# Altium schematic sheet Sheet1.SchDoc
size 420 x 297 mm; Organization: ФЕЛ, ДК-81; DocumentNumber: 1; SheetNumber: 1; SheetTotal: 1
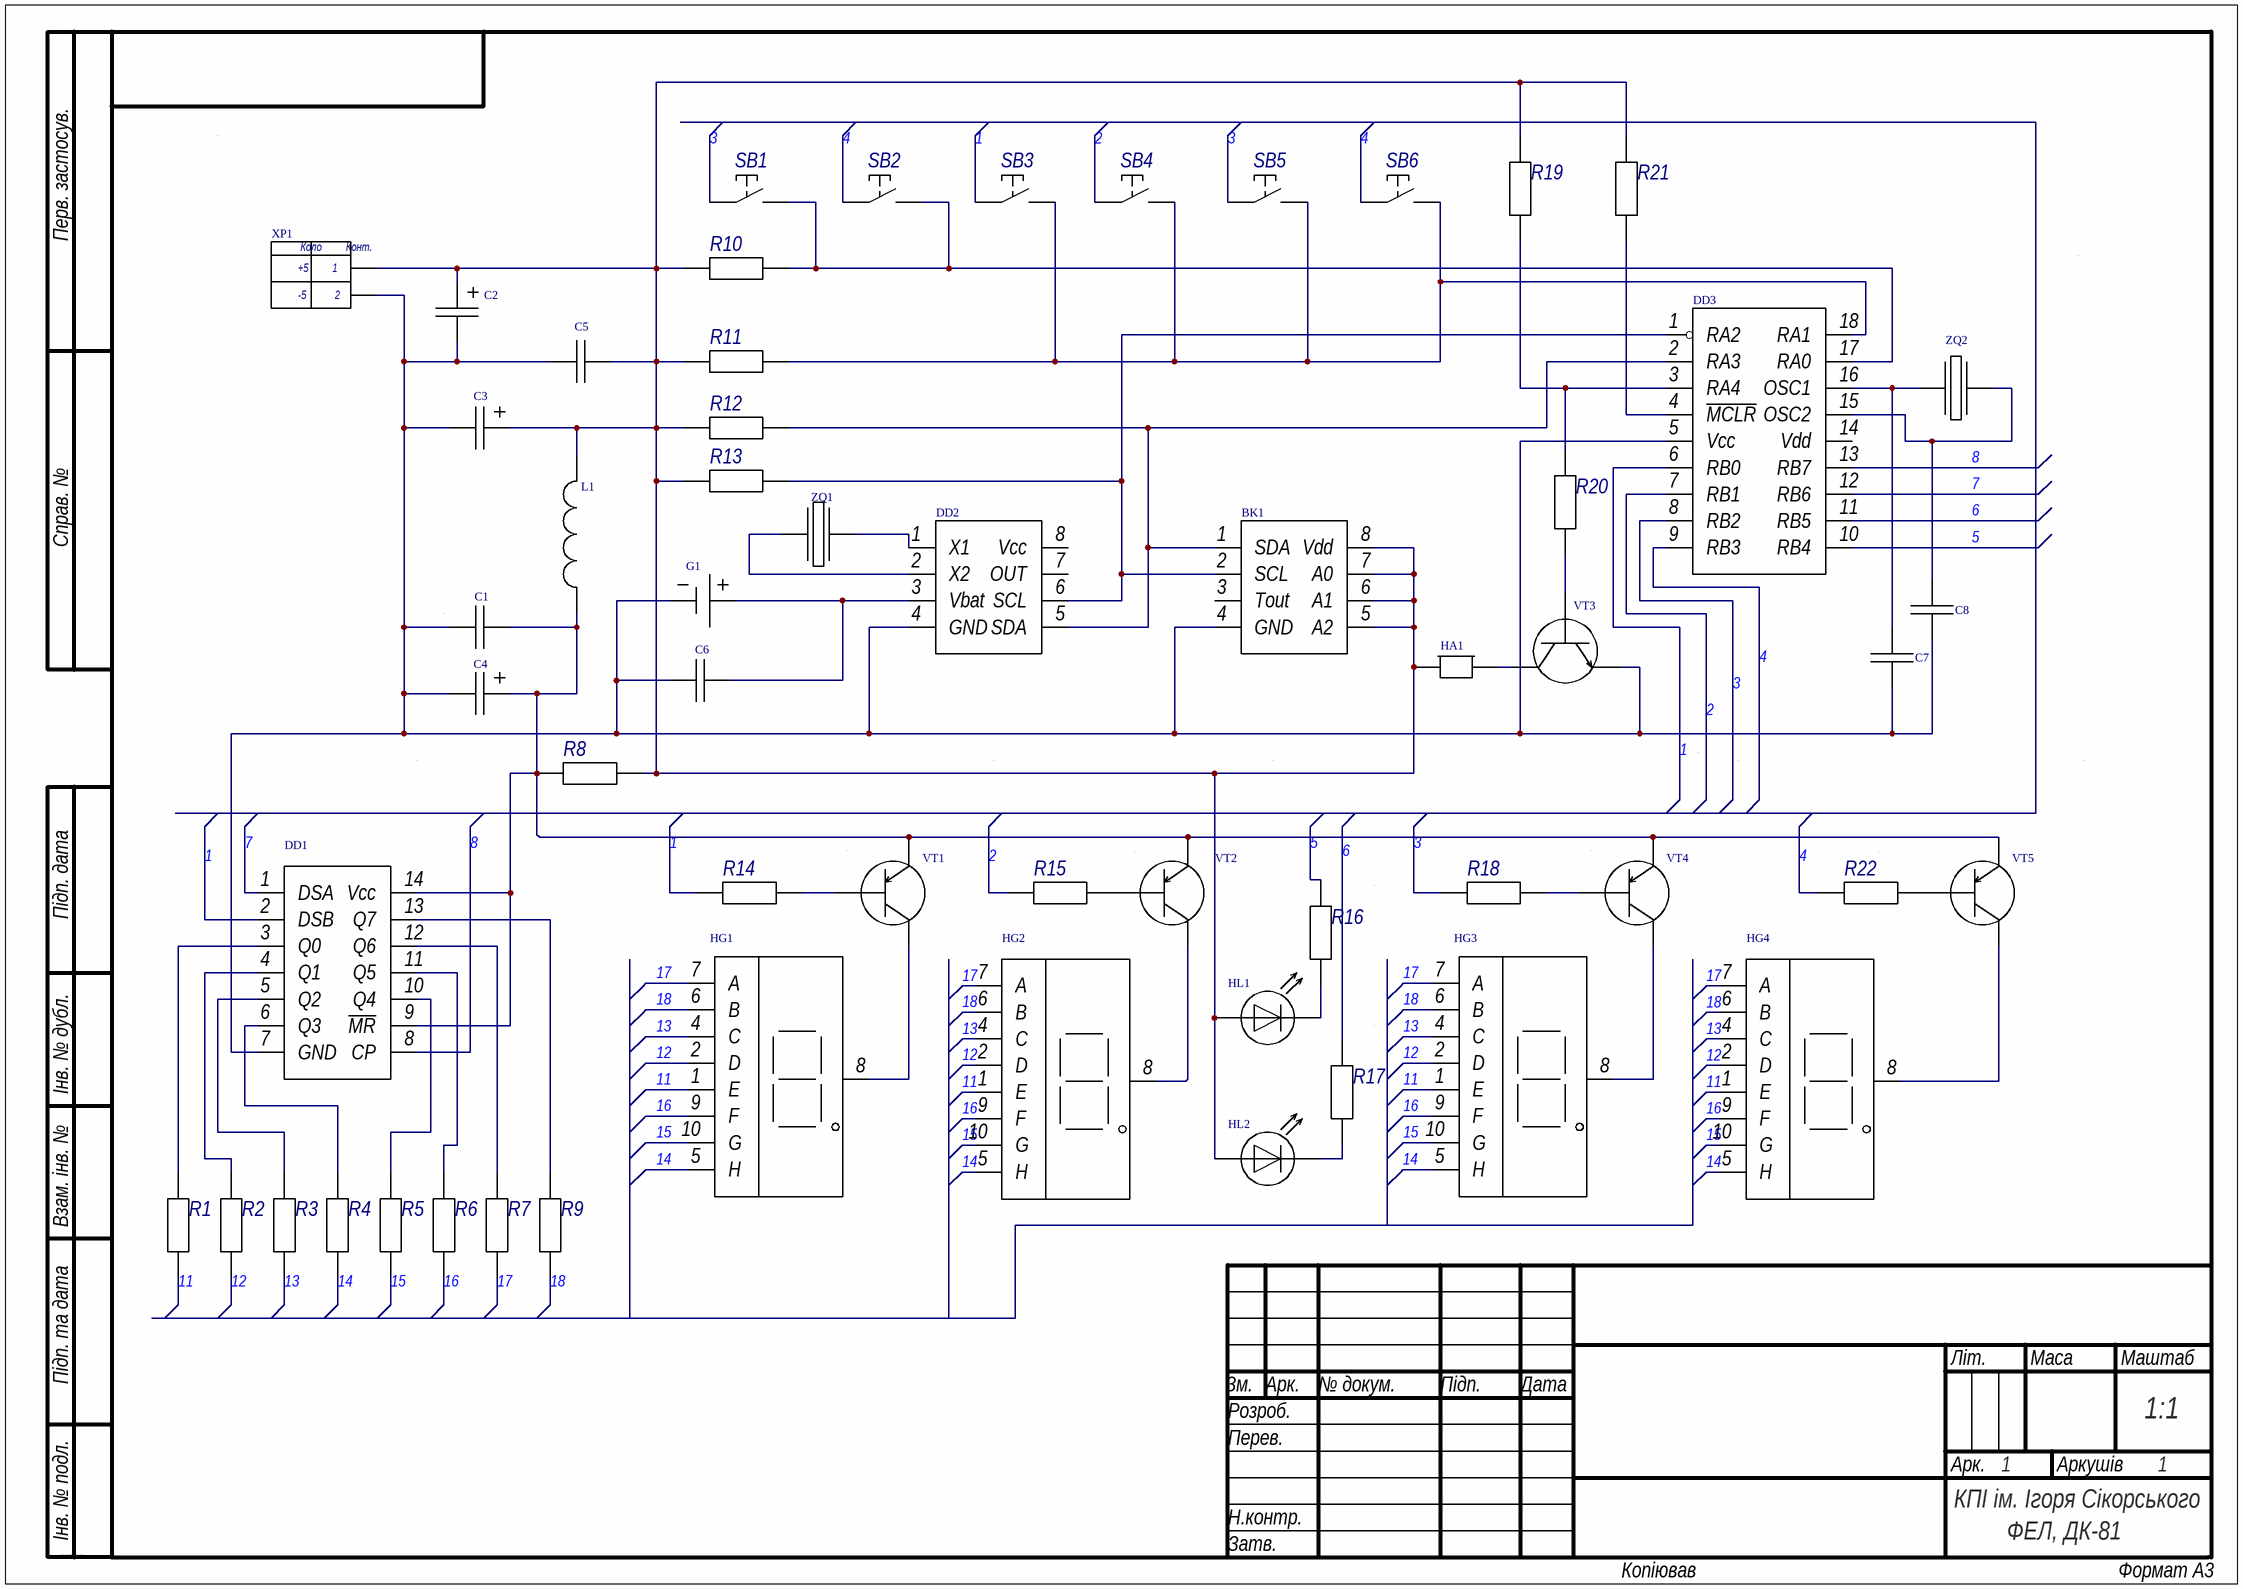
[diagram p0: Sheet1.SchDoc]

## Parts
BK1  DS1621 Maxim integrated  [DS1621]  (value not drawn)
C1  0805 63 В 0.1 мкФ 10% *  [0805_C]  (value not drawn)
C2  K50-35 16 В 470 мкФ 10% *  [ELECTROLYTHIC]  (value not drawn)
C3  K50-35 16 В 470 мкФ 10% *  [ELECTROLYTHIC]  (value not drawn)
C4  K50-35 16 В 470 мкФ 10% *  [ELECTROLYTHIC]  (value not drawn)
C5  0805 63 В 0.1 мкФ 10% *  [0805_C]  (value not drawn)
C6  0805 63 В 0.1 мкФ 10% *  [0805_C]  (value not drawn)
C7  С-0805 50 В 33 пФ 5% *  [0805_C]  (value not drawn)
C8  С-0805 50 В 33 пФ 5% *  [0805_C]  (value not drawn)
DD1  74HC164 Philips Semiconductors  [CD74HC164]  (value not drawn)
DD2  DS1307 Dallas Semiconductor  [DS1307]  (value not drawn)
DD3  PIC16F84A Microchip  [PIC16F84A]  (value not drawn)
G1  CR2032 MPD Devices  [CR2032]  (value not drawn)
HA1  1205FXP MULTICOMP  [1205FXP]  (value not drawn)
HG1  FYS-10012BUG Foryard optoelectronics  [SMA802W G/W]  (value not drawn)
HG2  FYS-10012BUG Foryard optoelectronics  [SMA802W G/W]  (value not drawn)
HG3  FYS-10012BUG Foryard optoelectronics  [SMA802W G/W]  (value not drawn)
HG4  FYS-10012BUG Foryard optoelectronics  [SMA802W G/W]  (value not drawn)
HL1  L-34GD Philips Semiconductors  [L-34GD]  (value not drawn)
HL2  74HC164 Philips Semiconductors  [L-34GD]  (value not drawn)
L1  WVL9FJ560K Vishay Dale  [WVL9FJ560K]  (value not drawn)
R1  R-0805 0.1 Вт 160 Ом 10% Yageo  [0805_R]  (value not drawn)
R2  R-0805 0.1 Вт 160 Ом 10% Yageo  [0805_R]  (value not drawn)
R3  R-0805 0.1 Вт 160 Ом 10% Yageo  [0805_R]  (value not drawn)
R4  R-0805 0.1 Вт 160 Ом 10% Yageo  [0805_R]  (value not drawn)
R5  R-0805 0.1 Вт 160 Ом 10% Yageo  [0805_R]  (value not drawn)
R6  R-0805 0.1 Вт 160 Ом 10% Yageo  [0805_R]  (value not drawn)
R7  R-0805 0.1 Вт 160 Ом 10% Yageo  [0805_R]  (value not drawn)
R8  R-0805 0.1 Вт 1 кОм 10% Yageo  [0805_R]  (value not drawn)
R9  R-0805 0.1 Вт 160 Ом 10% Yageo  [0805_R]  (value not drawn)
R10  R-0805 0.1 Вт 3 кОм 10% Yageo  [0805_R]  (value not drawn)
R11  R-0805 0.1 Вт 3 кОм 10% Yageo  [0805_R]  (value not drawn)
R12  R-0805 0.1 Вт 3 кОм 10% Yageo  [0805_R]  (value not drawn)
R13  R-0805 0.1 Вт 1 кОм 10% Yageo  [0805_R]  (value not drawn)
R14  R-0805 0.1 Вт 1 кОм 10% Yageo  [0805_R]  (value not drawn)
R15  R-0805 0.1 Вт 1 кОм 10% Yageo  [0805_R]  (value not drawn)
R16  R-0805 0.1 Вт 510 Ом 10% Yageo  [0805_R]  (value not drawn)
R17  R-0805 0.1 Вт 510 Ом 10% Yageo  [0805_R]  (value not drawn)
R18  R-0805 0.1 Вт 1 кОм 10% Yageo  [0805_R]  (value not drawn)
R19  R-0805 0.1 Вт 1 кОм 10% Yageo  [0805_R]  (value not drawn)
R20  R-0805 0.1 Вт 1 кОм 10% Yageo  [0805_R]  (value not drawn)
R21  R-0805 0.1 Вт 1 кОм 10% Yageo  [0805_R]  (value not drawn)
R22  R-0805 0.1 Вт 1 кОм 10% Yageo  [0805_R]  (value not drawn)
SB1  TS-A3PG-130 SWITRONIC INDUSTRIAL  [TS-A3PG-130]  (value not drawn)
SB2  TS-A3PG-130 SWITRONIC INDUSTRIAL  [TS-A3PG-130]  (value not drawn)
SB3  TS-A3PG-130 SWITRONIC INDUSTRIAL  [TS-A3PG-130]  (value not drawn)
SB4  TS-A3PG-130 SWITRONIC INDUSTRIAL  [TS-A3PG-130]  (value not drawn)
SB5  TS-A3PG-130 SWITRONIC INDUSTRIAL  [TS-A3PG-130]  (value not drawn)
SB6  TS-A3PG-130 SWITRONIC INDUSTRIAL  [TS-A3PG-130]  (value not drawn)
VT1  KT361B Zapad Pribor  [KT361B]  (value not drawn)
VT2  KT361B Zapad Pribor  [KT361B]  (value not drawn)
VT3  KT315B Zapad Pribor  [KT315B]  (value not drawn)
VT4  KT361B Zapad Pribor  [KT361B]  (value not drawn)
VT5  KT361B Zapad Pribor  [KT361B]  (value not drawn)
XP1  KLS1-AS-222-11 KLS  [KLS1-AS-222-11]  (value not drawn)
ZQ1  DT-38 SPC TECHNOLOGY  [DT-38]  (value not drawn)
ZQ2  HC-49S SPC TECHNOLOGY  [HC-49S]  (value not drawn)

## Nets
1: DD1.2(DSB) DD3.6(RB0) R14.1 SB3.1
2: DD3.7(RB1) R15.1 SB4.1
3: DD3.8(RB2) R18.1 SB1.1 SB5.1
4: DD3.9(RB3) R22.1 SB2.1 SB6.1
5: DD3.10(RB4) R16.2
6: DD3.11(RB5) R17.2
7: DD1.1(DSA) DD3.12(RB6)
8: DD1.8(CP) DD3.13(RB7)
11: HG1.1(E) HG2.1(E) HG3.1(E) HG4.1(E) R1.1
12: HG1.2(D) HG2.2(D) HG3.2(D) HG4.2(D) R2.1
13: HG1.4(C) HG2.4(C) HG3.4(C) HG4.4(C) R3.1
14: HG1.5(H) HG2.5(H) HG3.5(H) HG4.5(H) R4.1
15: HG1.10(G) HG2.10(G) HG3.10(G) HG4.10(G) R5.1
16: HG1.9(F) HG2.9(F) HG3.9(F) HG4.9(F) R6.1
17: HG1.7(A) HG2.7(A) HG3.7(A) HG4.7(A) R7.1
18: HG1.6(B) HG2.6(B) HG3.6(B) HG4.6(B) R9.1
NetBK1_1: BK1.1(SDA) DD2.5(SDA) DD3.2(RA3) R12.2
NetBK1_2: BK1.2(SCL) DD2.6(SCL) DD3.1(RA2) R13.2
NetBK1_4: BK1.4(GND) C1.1 C2.2 C3.2 C4.2 C5.1 C6.1 C7.1 C8.1 DD1.7(GND) DD2.4(GND) DD3.5(Vcc) G1.1 VT3.1 XP1.2
NetBK1_5: BK1.5(A2) BK1.6(A1) BK1.7(A0) BK1.8(Vdd) C2.1 C3.1 C5.2 HA1.1 HL1.1 HL2.1 L1.1 R8.2 R10.1 R11.1 R12.1 R13.1 R19.2 R21.2 XP1.1
NetC1_2: C1.2 C4.1 DD1.9(~{MR}) DD1.14(Vcc) L1.2 R8.1 VT1.1 VT2.1 VT4.1 VT5.1
NetC6_2: C6.2 DD2.3(Vbat) G1.2
NetC7_2: C7.2 DD3.16(OSC1) ZQ2.1
NetC8_2: C8.2 DD3.15(OSC2) ZQ2.2
NetDD1_3: DD1.3(Q0) R1.2
NetDD1_4: DD1.4(Q1) R2.2
NetDD1_5: DD1.5(Q2) R3.2
NetDD1_6: DD1.6(Q3) R4.2
NetDD1_10: DD1.10(Q4) R5.2
NetDD1_11: DD1.11(Q5) R6.2
NetDD1_12: DD1.12(Q6) R7.2
NetDD1_13: DD1.13(Q7) R9.2
NetDD2_1: DD2.1(X1) ZQ1.1
NetDD2_2: DD2.2(X2) ZQ1.2
NetDD3_3: DD3.3(RA4) R19.1 R20.2
NetDD3_4: DD3.4(~{MCLR}) R21.1
NetDD3_17: DD3.17(RA0) R10.2 SB1.2 SB2.2
NetDD3_18: DD3.18(RA1) R11.2 SB3.2 SB4.2 SB5.2 SB6.2
NetHA1_2: HA1.2 VT3.3
NetHG1_8: HG1.8 VT1.3
NetHG2_8: HG2.8 VT2.3
NetHG3_8: HG3.8 VT4.3
NetHG4_8: HG4.8 VT5.3
NetHL1_2: HL1.2 R16.1
NetHL2_2: HL2.2 R17.1
NetR14_2: R14.2 VT1.2
NetR15_2: R15.2 VT2.2
NetR18_2: R18.2 VT4.2
NetR20_1: R20.1 VT3.2
NetR22_2: R22.2 VT5.2

Not connected (* = marked no-connect by the designer): BK1 3(Tout); DD2 7(OUT) 8(Vcc); DD3 14(Vdd)

## Notes on the sheet
- Перв. застосув.
- Справ. №
- Підп. дата
- Інв. № дубл.
- Взам. інв. №
- Підп. та дата
- Зм.
- Розроб.
- Арк.
- № докум.
- Підп.
- Дата
- Літ.
- Маса
- Маштаб
- 1:1
- Перев.
- Аркушів
- Інв. № подл.
- Н.контр.
- Затв.
- КПІ ім. Ігоря Сікорського
- ALTIUM GOSTBOM2.0 KEV
- Копіював
- Формат А3
- (in symbol KLS1-AS-222-11) Коло; Конт.; +5; -5

## Library data of the parts
BK1 = DS1621: https://www.digikey.com/en/products/detail/maxim-integrated/DS1621V/1197054; Name: DS1621; Manufacturer: Maxim integrated
C1 C5 C6 = C 0.1 мкФ: https://product.tdk.com/en/system/files?file=dam/doc/product/capacitor/ceramic/mlcc/catalog/mlcc_automotive_soft_en.pdf; Voltage: 63 В; Value: 0.1 мкФ; Package: 0805; Tolerance: 10%; Temp_Coef: *; Manufacturer: *
C2-C4 = C 470 мкФ: https://www.nichicon.co.jp/english/products/pdfs/e-ucm.pdf; Voltage: 16 В; Value: 470 мкФ; Package: K50-35; Tolerance: 10%; Temp_Coef: *; Manufacturer: *
C7 C8 = C 33 пФ: https://media.digikey.com/pdf/Data%20Sheets/Knowles%20Syfer/MLCC_High_Reliability.pdf; Voltage: 50 В; Value: 33 пФ; Package: С-0805; Tolerance: 5%; Temp_Coef: *; Manufacturer: *
DD1 = 74HC164: https://www.digikey.com/en/products/detail/texas-instruments/CD74HC164M96/555785; Name: 74HC164; Manufacturer: Philips Semiconductors
DD2 = DS1307: https://www.digikey.com/en/products/detail/maxim-integrated/DS1307Z/956882; Name: DS1307; Manufacturer: Dallas Semiconductor
DD3 = PIC16F84A: https://www.digikey.com/en/products/detail/microchip-technology/PIC16F84A-04I-SS/303545; Name: PIC16F84A; Manufacturer: Microchip
G1 = CR2032: https://www.memoryprotectiondevices.com/datasheets/BU2032SM-FH-GTR-datasheet.pdf; Name: CR2032; Manufacturer: MPD Devices
HA1 = 1205FXP: Name: 1205FXP; Manufacturer: MULTICOMP
HG1-HG4 = SMA802W G/W: https://www.digikey.com/en/products/detail/american-opto-plus/SMA802W-G-W/13686837; Name: FYS-10012BUG; Manufacturer: Foryard optoelectronics
HL1 HL2 = L-34GD: https://www.tme.eu/ua/ru/details/l-34gd/svetodiody-tht-3mm/kingbright-electronic/?gclid=Cj0KCQjwppSEBhCGARIsANIs4p6Tk8y-EkAsvDV5NJn1Astt7FslfBwAzpVROw1eWOrpqwQt8y2AAxAaAr9iEALw_wcB&gclsrc=aw.ds; Manufacturer: Philips Semiconductors
  HL1: Name: L-34GD
  HL2: Name: 74HC164
L1 = WVL9FJ560K: https://www.digikey.com/en/products/detail/vishay-dale/WVL9FJ560K/8283799?s=N4IgTCBcDaIOoDUAyBOAYgKQKwDYAMA0iALoC%2BQA; Name: WVL9FJ560K; Manufacturer: Vishay Dale
R1-R7 R9 = R 160 Ом: https://www.digikey.com/en/products/detail/vishay-dale/CRCW0805160RJNEA/1175179; Power: 0.1 Вт; Value: 160 Ом; Package: R-0805; Tolerance: 10%; Manufacturer: Yageo
R8 R13-R15 R18-R22 = R 1 кОм: https://www.digikey.com/en/products/detail/koa-speer-electronics-inc/RK73G2ATTD1001D/13575930; Power: 0.1 Вт; Value: 1 кОм; Package: R-0805; Tolerance: 10%; Manufacturer: Yageo
R10-R12 = R 3 кОм: https://www.digikey.com/en/products/detail/rohm-semiconductor/KTR10EZPJ302/1763402; Power: 0.1 Вт; Value: 3 кОм; Package: R-0805; Tolerance: 10%; Manufacturer: Yageo
R16 R17 = R 510 Ом: https://www.digikey.com/en/products/detail/stackpole-electronics-inc/RMCF0805JT510R/1757915; Power: 0.1 Вт; Value: 510 Ом; Package: R-0805; Tolerance: 10%; Manufacturer: Yageo
SB1-SB6 = TS-A3PG-130: https://www.chipdip.ru/product0/8975490899; Name: TS-A3PG-130; Manufacturer: SWITRONIC INDUSTRIAL
VT1 VT2 VT4 VT5 = KT361B: https://eandc.ru/catalog/detail.php?ID=10318; Name: KT361B; Manufacturer: Zapad Pribor
VT3 = KT315B: https://eandc.ru/catalog/detail.php?ID=10270; Name: KT315B; Manufacturer: Zapad Pribor
XP1 = KLS1-AS-222-11: https://www.rcscomponents.kiev.ua/product/razem-pitaniya-ac-iec-60320-c8-kls1-as-222-11_117885.html; Name: KLS1-AS-222-11; Manufacturer: KLS
ZQ1 = DT-38: https://www.digikey.com/en/products/detail/cts-frequency-controls/520L15DT38M4000/4973212; Name: DT-38; Manufacturer: SPC TECHNOLOGY
ZQ2 = HC-49S: https://www.digikey.com/en/products/detail/w%C3%BCrth-elektronik/830003206B/13900488; Name: HC-49S; Manufacturer: SPC TECHNOLOGY